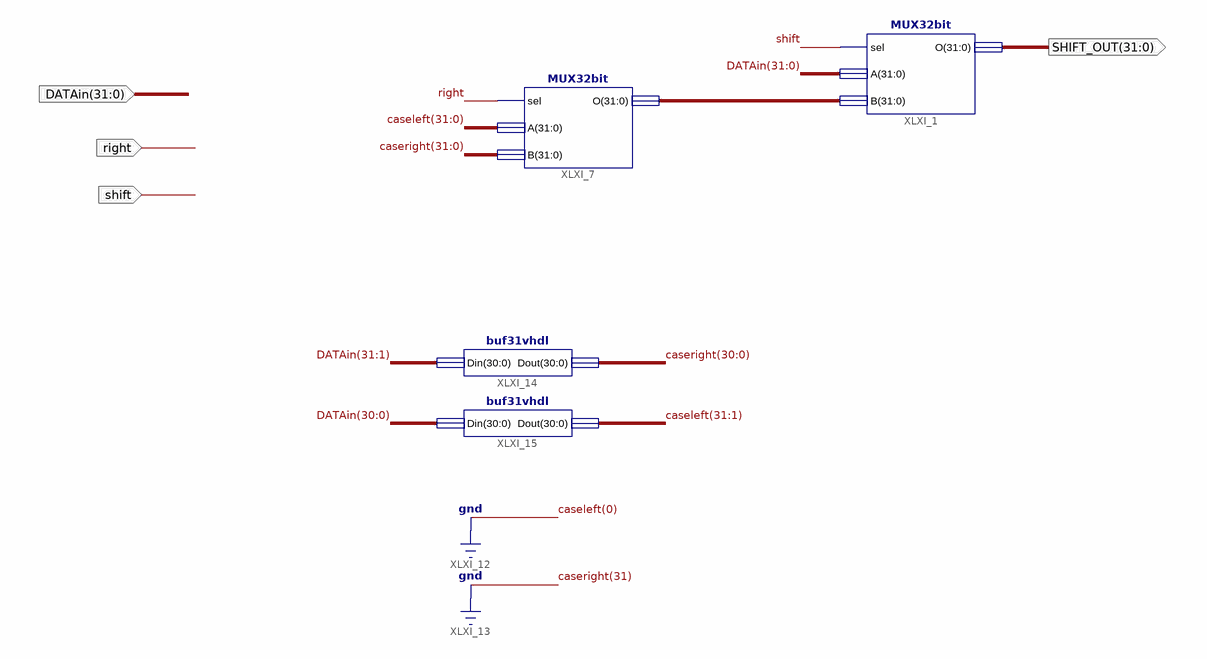
[diagram p0: schematic sheet 1]
// Xilinx ISE schematic shifter.sch (spartan2) as structural Verilog: 4 symbols, 4 ports
module shifter (
  input  [31:0] DATAin,
  input  shift,
  input  right,
  output [31:0] SHIFT_OUT
);

  wire [30:0] caseright;
  wire [31:0] XLXN_13;
  wire [31:1] caseleft;

  MUX32bit XLXI_1 (.sel(shift), .A(DATAin), .B(XLXN_13), .O(SHIFT_OUT));
  buf31vhdl XLXI_14 (.Din(DATAin[31:1]), .Dout(caseright));
  buf31vhdl XLXI_15 (.Din(DATAin[30:0]), .Dout(caseleft));
  MUX32bit XLXI_7 (.sel(right), .A({caseleft, 1'b0}), .B({1'b0, caseright}), .O(XLXN_13));
endmodule
